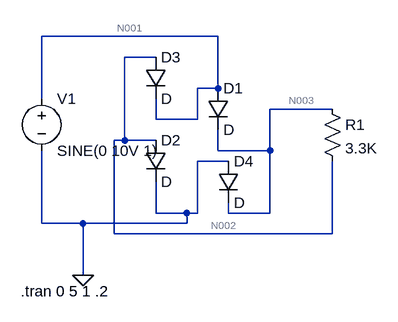
[diagram p0: schematic Draft1.asc]
Draft1.asc, the LTspice schematic file:
Version 4
SHEET 1 880 680
WIRE 272 16 0 16
WIRE 176 48 128 48
WIRE 272 96 272 16
WIRE 272 96 240 96
WIRE 0 112 0 16
WIRE 448 128 352 128
WIRE 176 144 176 112
WIRE 240 144 240 96
WIRE 240 144 176 144
WIRE 128 176 128 48
WIRE 128 176 112 176
WIRE 176 176 128 176
WIRE 272 192 272 160
WIRE 352 192 352 128
WIRE 352 192 272 192
WIRE 288 208 240 208
WIRE 176 288 176 240
WIRE 224 288 176 288
WIRE 240 288 240 208
WIRE 240 288 224 288
WIRE 288 288 288 272
WIRE 352 288 352 192
WIRE 352 288 288 288
WIRE 0 304 0 192
WIRE 64 304 0 304
WIRE 224 304 224 288
WIRE 224 304 64 304
WIRE 112 320 112 176
WIRE 448 320 448 208
WIRE 448 320 112 320
WIRE 64 384 64 304
FLAG 64 384 0
SYMBOL diode 256 96 R0
SYMATTR InstName D1
SYMBOL diode 160 176 R0
SYMATTR InstName D2
SYMBOL diode 160 48 R0
SYMATTR InstName D3
SYMBOL diode 272 208 R0
SYMATTR InstName D4
SYMBOL res 432 112 R0
SYMATTR InstName R1
SYMATTR Value 3.3K
SYMBOL voltage 0 96 R0
WINDOW 123 0 0 Left 0
WINDOW 39 0 0 Left 0
SYMATTR InstName V1
SYMATTR Value SINE(0 10V 1)
TEXT -32 408 Left 2 !.tran 0 5 1 .2

The netlist it stands for:
* Draft1.asc
D1 N001 N003 D
D2 N002 0 D
D3 N002 N001 D
D4 0 N003 D
R1 N003 N002 3.3K
V1 N001 0 SINE(0 10V 1)
.model D D
.lib standard.dio
.tran 0 5 1 .2
.backanno
.end

* Results of the author's LTspice run, read from the files saved beside the schematic
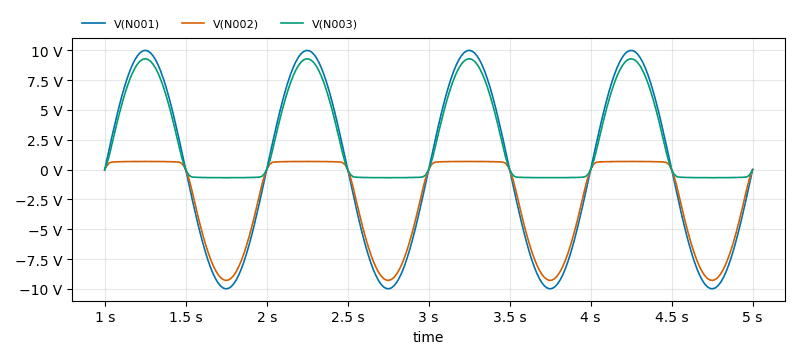
[diagram p1: Transient Analysis of Draft1.asc, plotted from the saved traces]
* Transient Analysis, 1 run:
*   V(N001): min -9.998 V, max 10 V, average 1.892 µV, rms 7.071 V, last 0 V
*   V(N002): min -9.293 V, max 679.9 mV, average -2.548 V, rms 4.588 V, last 0 V
*   V(N003): min -679.9 mV, max 9.295 V, average 2.548 V, rms 4.588 V, last 0 V